# Altium schematic sheet esquematico_microcontrolador.SchDoc
size A3; SheetNumber: 1; SheetTotal: 1
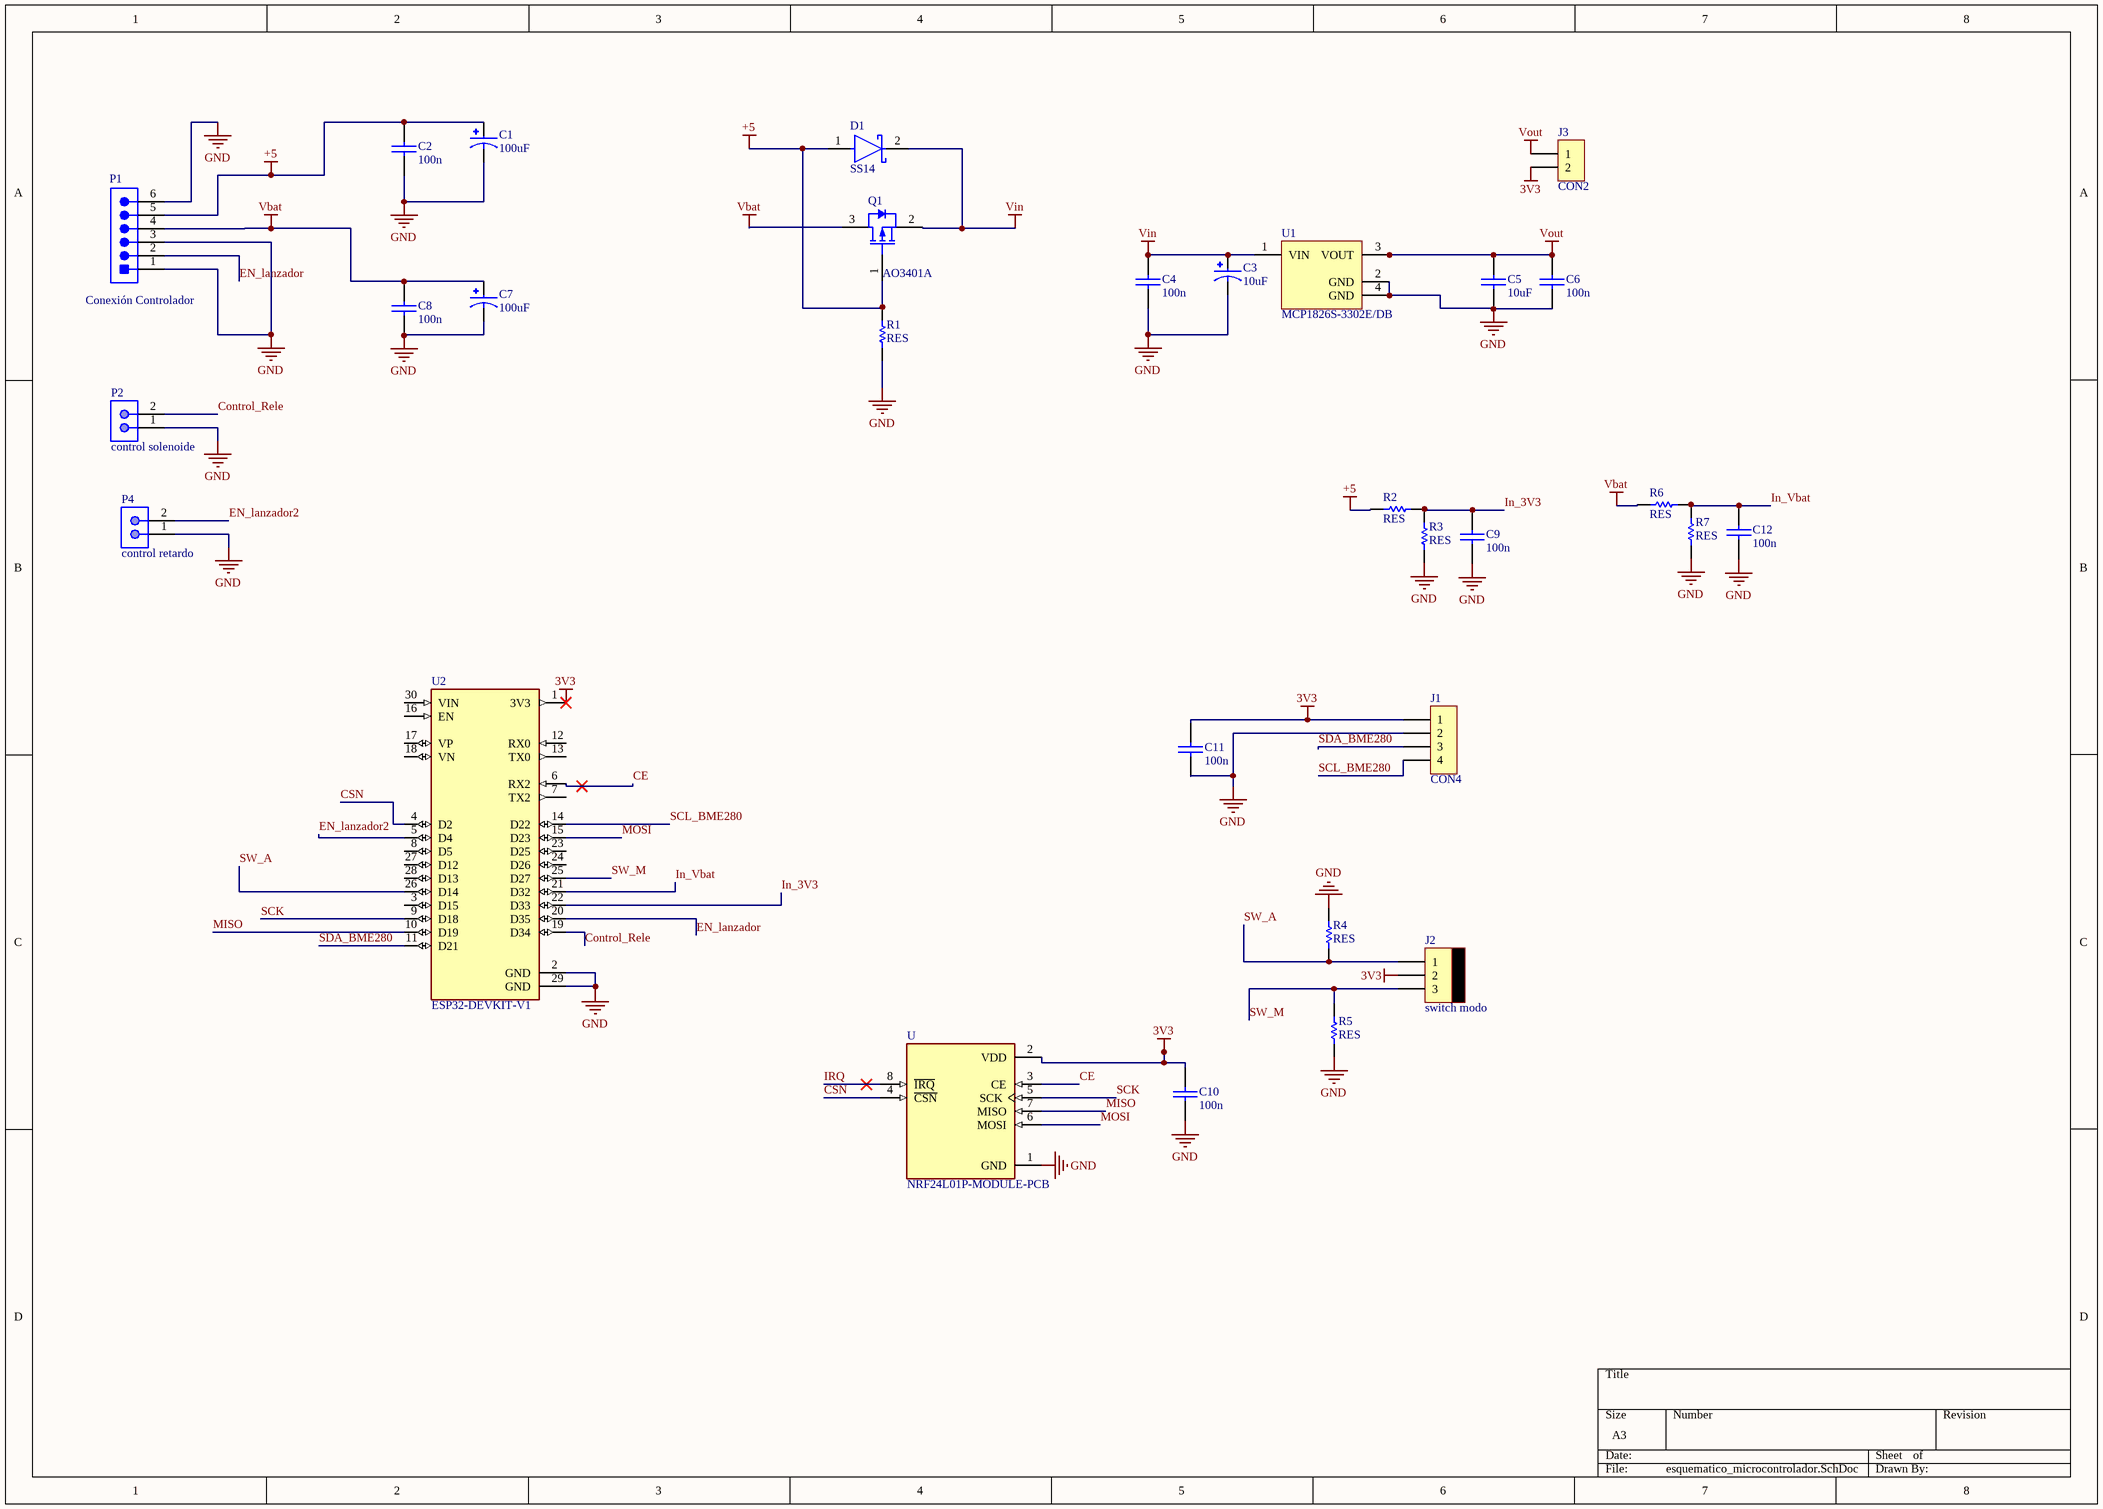
[diagram p0: esquematico_microcontrolador.SchDoc]

## Parts
C1  100uF  [CAP_EEEFN1V100R]
C2  100n  [1206]
C3  10uF  [CAP_EEEFN1V100R]
C4  100n  [1206]
C5  10uF  [1206]
C6  100n  [1206]
C7  100uF  [CAP_EEEFN1V100R]
C8  100n  [1206]
C9  100n  [0805]
C10  100n  [0805]
C11  100n  [0805]
C12  100n  [0805]
D1  SS14  [FP-403AE-MFG]
J1  CON4  [SIP4]
J2  switch modo  [MOLEX3]
J3  CON2  [SIP2]
P1  Conexión Controlador  [MOLX-22-23-2061_V]
P2  control solenoide  [MOLX-22-23-2021_V]
P4  control retardo  [MOLX-22-23-2021_V]
Q1  AO3401A  [AO-SOT-23-3L_V]
R1  RES  [0805]
R2  RES  [0805]
R3  RES  [0805]
R4  RES  [0805]
R5  RES  [0805]
R6  RES  [0805]
R7  RES  [0805]
U  NRF24L01P-MODULE-PCB  [XCVR_NRF24L01P-MODULE-PCB]
U1  MCP1826S-3302E/DB  [SOT-223-DB3_L]
U2  ESP32-DEVKIT-V1  [MODULE_ESP32_DEVKIT_V1]

## Nets
3V3: C10.1 C11.1 J1.1 J2.2 J3.2 U.2(VDD) U2.1(3V3)
+5: C1.1 C2.1 D1.1(A) P1.5 Q1.1(GATE) R1.2 R2.2
GND: C1.2 C2.2 C3.2 C4.2 C5.2 C6.2 C7.2 C8.2 C9.2 C10.2 C11.2 C12.2 J1.2 P1.1 P1.3 P1.6 P2.1 P4.1 R1.1 R3.1 R4.2 R5.1 R7.1 U.1(GND) U1.2(GND) U1.4(GND) U2.2(GND) U2.29(GND)
Vbat: C7.1 C8.1 P1.4 Q1.3(DRAIN) R6.2
Vin: C3.1 C4.1 D1.2(C) Q1.2(SOURCE) U1.1(VIN)
Vout: C5.1 C6.1 J3.1 U1.3(VOUT)
CE: U.3(CE) U2.6(RX2)
Control_Rele: P2.2 U2.19(D34)
CSN: U.4(~{CSN}) U2.4(D2)
EN_lanzador: P1.2 U2.20(D35)
EN_lanzador2: P4.2 U2.5(D4)
In_3V3: C9.1 R2.1 R3.2 U2.22(D33)
In_Vbat: C12.1 R6.1 R7.2 U2.21(D32)
IRQ: U.8(~{IRQ})
MISO: U.7(MISO) U2.10(D19)
MOSI: U.6(MOSI) U2.15(D23)
SCK: U.5(SCK) U2.9(D18)
SCL_BME280: J1.4 U2.14(D22)
SDA_BME280: J1.3 U2.11(D21)
SW_A: J2.1 R4.1 U2.26(D14)
SW_M: J2.3 R5.2 U2.25(D27)

Not connected (* = marked no-connect by the designer): U2 3(D15) 7(TX2) 8(D5) 12(RX0) 13(TX0) 16(EN) 17(VP) 18(VN) 23(D25) 24(D26) 27(D12) 28(D13) 30(VIN)

## Library data of the parts
C1 C3 C7 = EEEFN1V100R: 10µF 35V Aluminum Electrolytic Capacitors Radial, Can - SMD 1.35Ohm @ 100kHz 2000 Hrs @ 105°C; MF: Panasonic; Purchase-URL: https://pricing.snapeda.com/search?q=EEEFN1V100R&ref=eda; Package: RADIAL-2 Panasonic; Check_prices: https://www.snapeda.com/parts/EEEFN1V100R/Panasonic/view-part/?ref=eda; Value: *; SnapEDA_Link: https://www.snapeda.com/parts/EEEFN1V100R/Panasonic/view-part/?ref=snap; MP: EEEFN1V100R; Digi-Key_Part_Number: 10-EEE-FN1V100RTR-ND
C2 C4 C8-C10 C12 = CAP
C5 = CAP: Capacitor 10uF a 22uF X5R 1206
C6 C11 = CAP: Capacitor 100n NP0 1206 o 0805 (cambiar footprint 0805)
D1 = CMP-2000-04943-2: DIODE SCHOTTKY 40V 1A SMA; Manufacturer: ON Semiconductor; Peak Reverse Current: 0.2mA; Max Junction Temp: +125°C; Standoff Height: 0.05mm; Max Surge Forward Current: 40A; Mouser Description: Schottky Diodes & Rectifiers SMA 40V 1.0A; RoHS: TRUE; Lead Free: Yes; Manufacturer Part Number: SS14; Device Class L3: Schottky Diodes; Category: Diode; Automotive: No; Digikey Description: DIODE SCHOTTKY 40V 1A SMA; ComponentLink2Description: Datasheet; Device Class L2: Diodes; Height: 2.5mm; Temperature Range High: +125°C; ComponentLink2URL: https://www.onsemi.com/pub/Collateral/SS19-D.PDF; Device Class L1: Discrete Semiconductors; Package: 403AE; Octopart: https://octopart.com/ss14-on+semiconductor-29205033; Max Repetitive Reverse Voltage: 40V; Temperature Range Low: -65°C; Forward Current: 1A; Temperature: -65°C to +125°C
J2 = MOLEX3
P1 = CMP-2000-05536-1: Male Header, Pitch 2.54 mm, 1 x 6 Position, Height 10.67 mm, Tail Length 3.56 mm, 0 to 70 degC, RoHS, Bulk; Manufacturer: Molex; Pitch: 2.54mm; Mounting Angle: Vertical; Current Rating: 4A; Number of Positions / Contacts: 6; Voltage Rating: 250V; Packaging: Bulk; Package Description: Male Header, Pitch 2.54 mm, 1 x 6 Position, Height 10.67 mm, Tail Length 3.56 mm; Number of Rows: 1; Type: PinStrip; Contact Material: Brass; Product Category: .100K.K.Connectors; Factory Pack Quantity: 1000; Mounting Style: ThroughHole; RoHS: Details; Contact Plating: Tin; Housing Material: Nylon; Mounting Technology: ThroughHole; Termination Style: ThroughHole; Tradename: KK; Number of Positions: 6; Brand: Molex; Product Type: Headers; Series: 6373; Datasheet URL: https://datasheet.ciiva.com/19460/232303-19460895.pdf; Package Reference: 22-23-2061; Datasheet Version: Rev. P, 09/2001; Manufacturer URL: http://www.molex.com/
P2 P4 = CMP-1704-00001-3: Male Header, Pitch 2.54 mm, 1 x 2 Position, Height 10.67 mm, Tail Length 3.56 mm, 0 to 75 degC, RoHS, Bulk; Package Quantity: 3000; Height: 10.67 mm; RoHSCompliant: True; ComponentLink2URL: https://datasheet.ciiva.com/19454/232266-19454304.pdf; PartNumber: 22-23-2021; Packaging: Bulk; ComponentLink2Description: Datasheet; Min Operating Temperature: 0 degC; ComponentLink1Description: Manufacturer URL; Length: 5.08 mm; Mounting Technology: Through Hole; Max Operating Temperature: 75 degC; REACH SVHC: Unknown; PackageDescription: Male Header, Pitch 2.54 mm, 1 x 2 Position, Height 10.67 mm, Tail Length 3.56 mm; ComponentLink1URL: http://www.molex.com/; Mount: Through Hole; Radiation Hardening: No; Width: 6.35 mm; Pins: 2
Q1 = CMP-2000-05778-1: P-Channel MOSFET, 30 V, 4 A, -55 to 150 degC, 3-Pin SOT-23-3L, RoHS, Tape and Reel; Manufacturer: Alpha and Omega; Output Power (Max): NotRequiredW; Power Dissipation: 1.4W; Rad Hardened: No; Drain Efficiency: NotRequired%; Drain-Source On-Volt: 30V; Noise Figure: NotRequireddB; Frequency (Max): NotRequiredMHz; Number of  Elements: 1; Gate-Source Voltage (Max): ?12V; Drain Current (Max): 4A; Channel Mode: Enhancement; Drain-Source On-Res: 0.044ohm; Type: PowerMOSFET; Polarity: P; Package URL: http://www.aosmd.com/res/packaging_information/SOT-23-3L.pdf; Datasheet URL: http://www.aosmd.com/res/data_sheets/AO3401A.pdf; Package Type: SOT-23; Package Description: 3-Pin Small Outline Transistor, Body 2.95 x 1.6 mm, Pitch 0.95 mm; Mounting: SurfaceMount; Manufacturer URL: http://www.aosmd.com/; Continuous Drain Current: 4A; Package Reference: SOT-23-3L; Mounting Technology: SurfaceMount; Operating Temperature Classification: Military; Power Gain: NotRequireddB; Datasheet Version: Rev. 3, 03/2011; Operating Temp Range: -55Cto150C; Pin Count: 3
U = NRF24L01P-MODULE-PCB: - Transceiver For Use With nRF24L01+; MF: Nordic Semiconductor; Package: None; MP: NRF24L01P-MODULE-PCB; Value: *; Availability: Bad; Price: None; SnapEDA_Link: https://www.snapeda.com/parts/NRF24L01P-MODULE-PCB/Nordic%20Semiconductor%20ASA/view-part/230534/?ref=snap; Mouser-Purchase-URL: https://snapeda.com/shop?store=Mouser&id=230534
U1 = CMP-0136-00504-1: 1000 mA, Low Voltage, Low Quiescent Current LDO Regulator, 3-Pin SOT-223, Extended Temperature; PackageVersion: revBB, Aug-2009; PackageReference: SOT-223-DB3; DatasheetVersion: revA, Aug-2007; PackageDescription: 3-Lead Plastic Small Outline Transistor (DB) [SOT-223]
U2 = ESP32-DEVKIT-V1: Dual core, Wi-Fi: 2.4 GHz up to 150 Mbits/s,BLE (Bluetooth Low Energy) and legacy Bluetooth, 32 bits, Up to 240 MHz; MF: Do it; SnapEDA_Link: https://www.snapeda.com/parts/ESP32-DEVKIT-V1/Do+it/view-part/?ref=snap; Package: None; Value: *; MP: ESP32-DEVKIT-V1; Check_prices: https://www.snapeda.com/parts/ESP32-DEVKIT-V1/Do+it/view-part/?ref=eda